# EAGLE design os23ac (EAGLE 7.2.0)
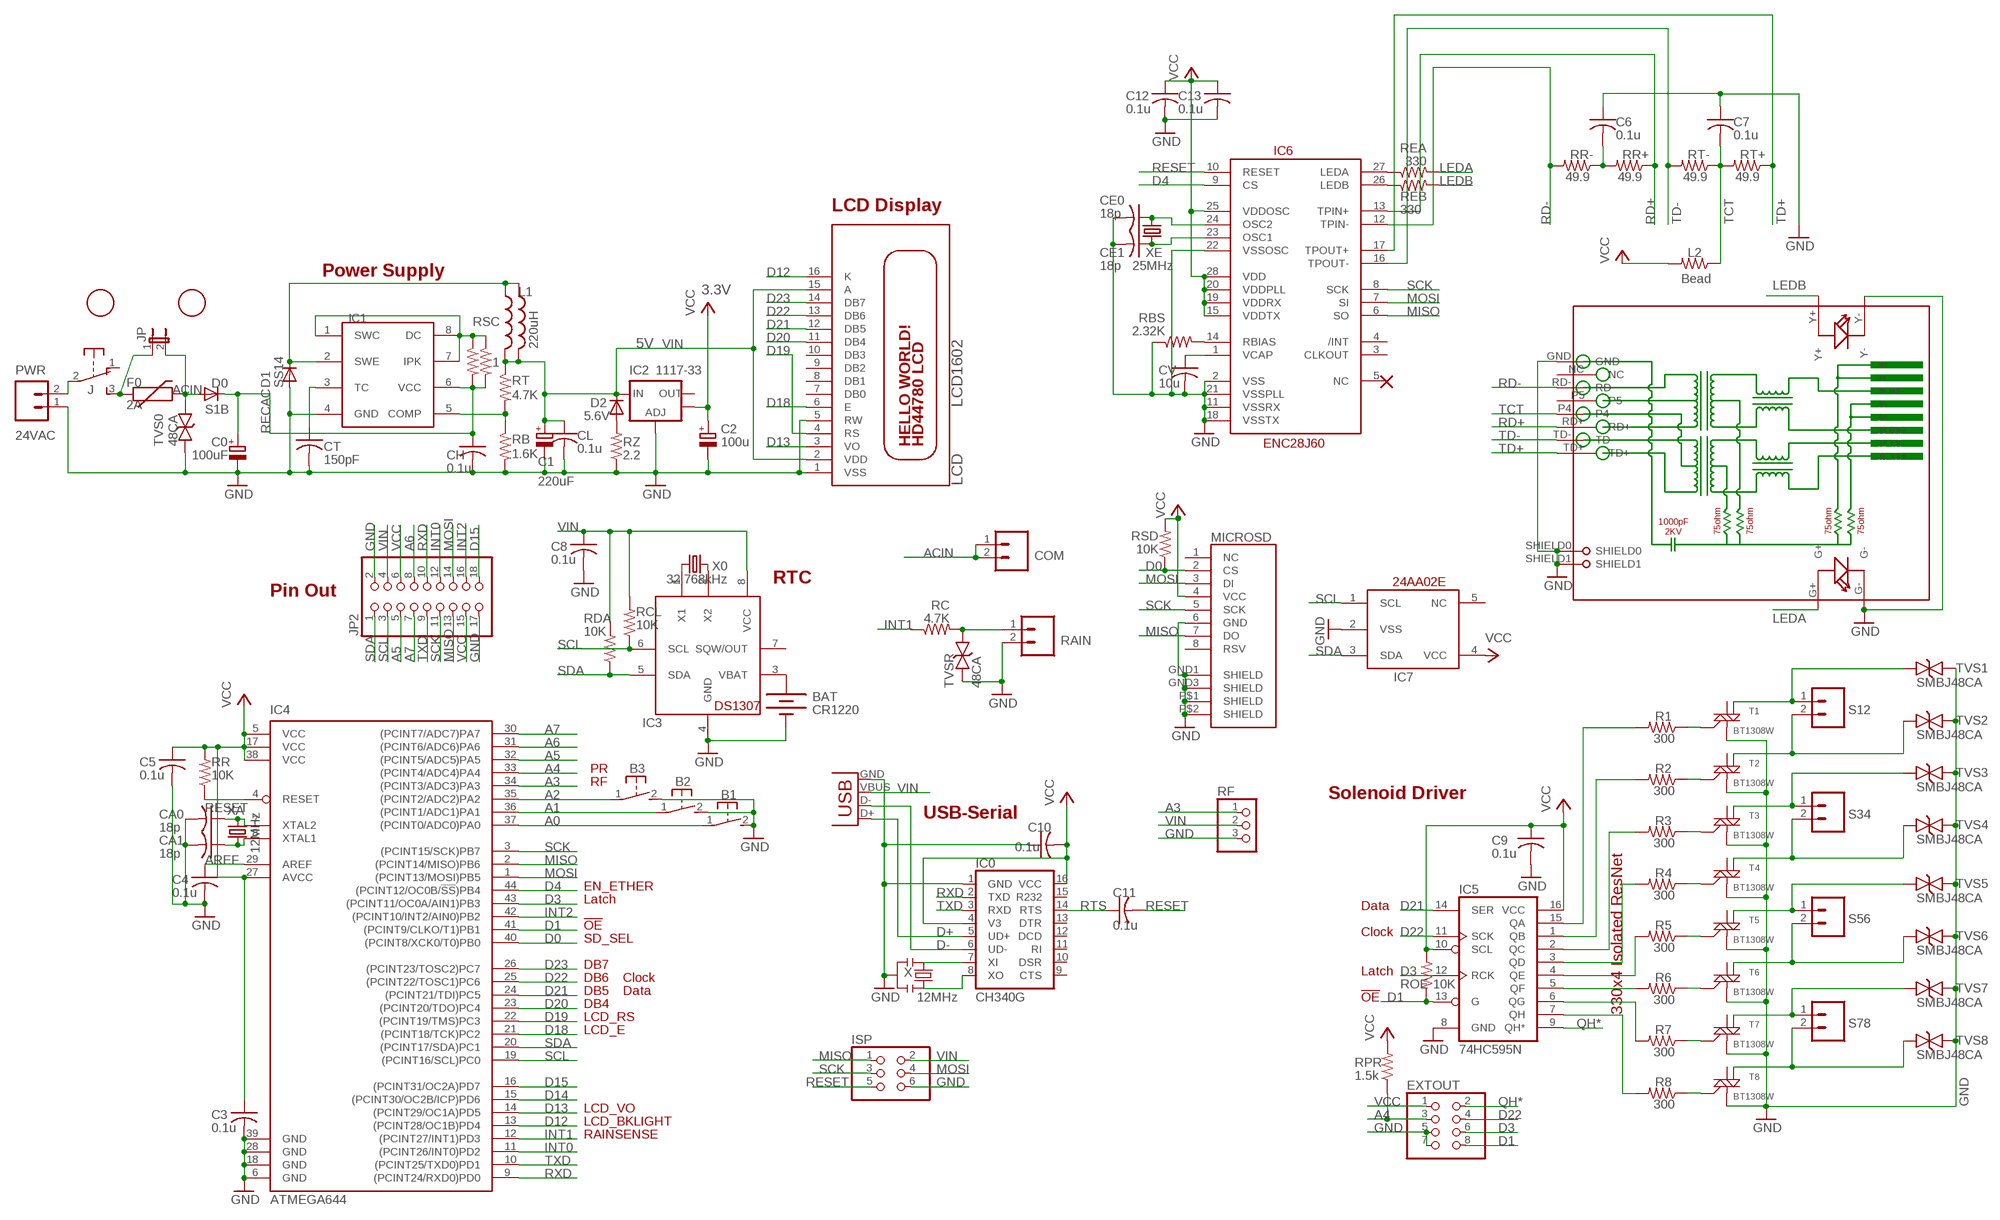
[diagram p0: schematic, sheet 1]

## Parts
B1  31-XX  [B3F-31XX]
B2  31-XX  [B3F-31XX]
B3  31-XX  [B3F-31XX]
BAT  CR1220  BATTERYBATTERY_12MM_SMT  [BATTCON_12MM_SMT]
C0  100uF  CPOL-EUE  [PANASONIC_E]
C1  220uF  CPOL-EUE  [PANASONIC_E]
C2  100u  CPOL-EUD  [PANASONIC_D]
C3  0.1u  C-USC0603K  [C0603K]
C4  0.1u  C-USC0603  [C0603]
C5  0.1u  C-USC0603  [C0603]
C6  0.1u  C-USC0603  [C0603]
C7  0.1u  C-USC0603K  [C0603K]
C8  0.1u  C-USC0603  [C0603]
C9  0.1u  C-USC0603  [C0603]
C10  0.1u  C-USC0603  [C0603]
C11  0.1u  C-USC0603  [C0603]
C12  0.1u  C-USC0603  [C0603]
C13  0.1u  C-USC0603  [C0603]
CA0  18p  C-USC0603K  [C0603K]
CA1  18p  C-USC0603K  [C0603K]
CE0  18p  C-USC0603K  [C0603K]
CE1  18p  C-USC0603K  [C0603K]
CH  0.1u  C-USC0603  [C0603]
CL  0.1u  C-USC0603  [C0603]
COM  M025MM-X  [SCREWTERMINAL-5MM-2-X]
CT  150pF  C-USC0603K  [C0603K]
CV  10u  C-USC0805K  [C0805K]
D0  S1B  DIODE-DO-214AC  [DO-214AC]
D1  SS14  DIODE-DO-214AC  [DO-214AC]
D2  5.6V  DIODE-MINIMELF  [MINIMELF]
EXTOUT  PINHD-2X4  [2X04]
F0  2A  PTCSMD  [PTC-1206]
IC0  CH340G  [SO16]
IC1  34063  MC33063/MC34063D  [SO08]
IC2  1117-33  V_REG_LM1117SOT223  [SOT223]
IC3  DS1307  DS1307SOIC  [SO08]
IC4  ATMEGA644  ATMEGA644A  [TQFP44]
IC5  74HC595N  74LS595D  [SO16]
IC6  ENC28J60  [SSOP28DB]
IC7  24AA02E  24AA02E48  [SOT23-5L]
ISP  PINHD-2X3  [2X03]
J  EG1206  [EG1206]
JP  JUMPER-2PTH  [1X02]
JP2  PINHD-2X9-CBIG  [2X09-CLEANBIG]
L1  INDUCTORPWR  [CDRH125]
L1'  220uH  L-US0204/5  [0204/5]
L2  Bead  R-US_R0805  [R0805]
LCD  LCD1602  HD44780LCDNOHOLE  [LCD1602A]
MICROSD  USD-SOCKETMICRO-SD-SOCKET-TAOBAO  [MICRO-SD-SOCKET-TAOBAO]
PWR  24VAC  M024MM-X  [SCREWTERMINAL-4MM-2-X]
R1  300  R-US_R0603  [R0603]
R2  300  R-US_R0603  [R0603]
R3  300  R-US_R0603  [R0603]
R4  300  R-US_R0603  [R0603]
R5  300  R-US_R0603  [R0603]
R6  300  R-US_R0603  [R0603]
R7  300  R-US_R0603  [R0603]
R8  300  R-US_R0603  [R0603]
RAIN  M025MM-X  [SCREWTERMINAL-5MM-2-X]
RB  1.6K  R-US_R0603  [R0603]
RBS  2.32K  R-US_R0805  [R0805]
RC  4.7K  R-US_R0805  [R0805]
RCL  10K  R-US_R0603  [R0603]
RDA  10K  R-US_R0603  [R0603]
REA  330  R-US_R0603  [R0603]
REB  330  R-US_R0603  [R0603]
RF  PINHD-1X3  [1X03]
RJ45  HR911105A  [HR911105A]
ROE  10K  R-US_R0603  [R0603]
RPR  1.5k  R-US_R0603  [R0603]
RR  10K  R-US_R0603  [R0603]
RR+  49.9  R-US_R0603  [R0603]
RR-  49.9  R-US_R0603  [R0603]
RSC  1  R-US_R0805  [R0805]
RSC1  1  R-US_R0805  [R0805]
RSD  10K  R-US_R0603  [R0603]
RT  4.7K  R-US_R0805  [R0805]
RT+  49.9  R-US_R0603  [R0603]
RT-  49.9  R-US_R0603  [R0603]
RZ  2.2  R-US_R2010  [R2010]
S12  M025MM-X  [SCREWTERMINAL-5MM-2-X]
S34  M025MM-X  [SCREWTERMINAL-5MM-2-X]
S56  M025MM-X  [SCREWTERMINAL-5MM-2-X]
S78  M025MM-X  [SCREWTERMINAL-5MM-2-X]
T1  BT1308W  MAC97SOT223  [SOT223]
T2  BT1308W  MAC97SOT223  [SOT223]
T3  BT1308W  MAC97SOT223  [SOT223]
T4  BT1308W  MAC97SOT223  [SOT223]
T5  BT1308W  MAC97SOT223  [SOT223]
T6  BT1308W  MAC97SOT223  [SOT223]
T7  BT1308W  MAC97SOT223  [SOT223]
T8  BT1308W  MAC97SOT223  [SOT223]
TVS0  48CA  DIODE-BTVSSMB  [SMB]
TVS1  SMBJ48CA  DIODE-BTVSSMB  [SMB]
TVS2  SMBJ48CA  DIODE-BTVSSMB  [SMB]
TVS3  SMBJ48CA  DIODE-BTVSSMB  [SMB]
TVS4  SMBJ48CA  DIODE-BTVSSMB  [SMB]
TVS5  SMBJ48CA  DIODE-BTVSSMB  [SMB]
TVS6  SMBJ48CA  DIODE-BTVSSMB  [SMB]
TVS7  SMBJ48CA  DIODE-BTVSSMB  [SMB]
TVS8  SMBJ48CA  DIODE-BTVSSMB  [SMB]
TVSR  48CA  DIODE-BTVSSMB  [SMB]
U$1  FIDUCIAL  [FIDUCIAL_1MM]
U$3  FIDUCIAL  [FIDUCIAL_1MM]
USB  USBPTH  [USB-B-PTH]
X  12MHz  RESONATORSMD  [RESONATOR-SMD]
X0  32.768kHz  CRYSTALMM20SS  [MM20SS]
XA  12MHz  CRYSTAL4SMD  [4SMD]
XE  25MHz  CRYSTAL4SMD  [4SMD]

## Nets
A0: B1.1(P) IC4.37((PCINT0/ADC0)PA0)
A1: B2.1(P) IC4.36((PCINT1/ADC1)PA1)
A2: B3.1(P) IC4.35((PCINT2/ADC2)PA2)
A3: IC4.34((PCINT3/ADC3)PA3) RF.1
A4: EXTOUT.3 IC4.33((PCINT4/ADC4)PA4) RPR.1
A5: IC4.32((PCINT5/ADC5)PA5) JP2.5
A6: IC4.31((PCINT6/ADC6)PA6) JP2.8
A7: IC4.30((PCINT7/ADC7)PA7) JP2.7
ACIN [power]: COM.1 COM.2 D0.A F0.2 JP.2 TVS0.C
AREF: C4.1 IC4.29(AREF)
D0: IC4.40((PCINT8/XCK0/T0)PB0) MICROSD.2(CS) RSD.1
D1: EXTOUT.8 IC4.41((PCINT9/CLKO/T1)PB1) IC5.13(G) ROE.1
D3: EXTOUT.6 IC4.43((PCINT11/OC0A/AIN1)PB3) IC5.12(RCK)
D4: IC4.44((PCINT12/OC0B/!SS!)PB4) IC6.9(CS)
D12: IC4.13((PCINT28/OC1B)PD4) LCD.16(K)
D13: IC4.14((PCINT29/OC1A)PD5) LCD.3(VO)
D14: IC4.15((PCINT30/OC2B/ICP)PD6)
D15: IC4.16((PCINT31/OC2A)PD7) JP2.18
D18: IC4.21((PCINT18/TCK)PC2) LCD.6(E)
D19: IC4.22((PCINT19/TMS)PC3) LCD.4(RS)
D20: IC4.23((PCINT20/TDO)PC4) LCD.11(DB4)
D21: IC4.24((PCINT21/TDI)PC5) IC5.14(SER) LCD.12(DB5)
D22: EXTOUT.4 IC4.25((PCINT22/TOSC1)PC6) IC5.11(SCK) LCD.13(DB6)
D23: IC4.26((PCINT23/TOSC2)PC7) LCD.14(DB7)
D+: IC0.5(UD+) USB.D+
D-: IC0.6(UD-) USB.D-
GND: B1.2(S) B2.2(S) B3.2(S) BAT.P$1(-) C0.- C1.- C2.- C3.2 C4.2 C5.2 C6.1 C7.1 C8.2 C9.2 C10.1 C12.2 C13.2 CA0.2 CA1.2 CE0.2 CE1.2 CH.2 CL.2 CT.2 CV.2 D1.A EXTOUT.5 EXTOUT.7 IC0.1(GND) IC1.4(GND) IC2.1(ADJ) IC3.4(GND) IC4.6(GND) IC4.18(GND) IC4.28(GND) IC4.39(GND) IC5.8(GND) IC6.2(VSS) IC6.11(VSSRX) IC6.18(VSSTX) IC6.21(VSSPLL) IC6.22(VSSOSC) IC7.2(VSS) ISP.6 JP2.2 JP2.17 LCD.1(VSS) LCD.5(RW) MICROSD.6(GND) MICROSD.GND1(SHIELD) MICROSD.GND3(SHIELD) MICROSD.P$1(SHIELD) MICROSD.P$2(SHIELD) PWR.1 RAIN.2 RB.2 RBS.1 RF.3 RJ45.G- RJ45.GND RJ45.SHIELD0 RJ45.SHIELD1 RJ45.Y- RZ.1 T1.1(M1) T2.1(M1) T3.1(M1) T4.1(M1) T5.1(M1) T6.1(M1) T7.1(M1) T8.1(M1) TVS0.A TVS1.C TVS2.C TVS3.C TVS4.C TVS5.C TVS6.C TVS7.C TVS8.C TVSR.A USB.GND X.2
INT0: IC4.11((PCINT26/INT0)PD2) JP2.12
INT1: IC4.12((PCINT27/INT1)PD3) RC.1
INT2: IC4.42((PCINT10/INT2/AIN0)PB2) JP2.16
LEDA: REA.2 RJ45.G+
LEDB: REB.2 RJ45.Y+
MISO: IC4.2((PCINT14/MISO)PB6) IC6.6(SO) ISP.1 JP2.13 MICROSD.7(DO)
MOSI: IC4.1((PCINT13/MOSI)PB5) IC6.7(SI) ISP.4 JP2.14 MICROSD.3(DI)
N$1: J.2(P) PWR.2
N$3: RAIN.1 RC.2 TVSR.C
N$4: IC5.5(QF) R6.2
N$5: IC5.6(QG) R7.2
N$6: IC0.7(XI) X.1
N$7: IC5.7(QH) R8.2
N$8: IC3.1(X1) X0.1
N$9: F0.1 J.3(S) JP.1
N$10: IC5.4(QE) R5.2
N$11: IC5.3(QD) R4.2
N$12: IC5.2(QC) R3.2
N$13: IC5.1(QB) R2.2
N$14: IC5.15(QA) R1.2
N$15: CA0.1 IC4.7(XTAL2) XA.1
N$16 [power]: S12.1 T1.4(M2-4) TVS1.A
N$17 [power]: S12.2 T2.4(M2-4) TVS2.A
N$18 [power]: S34.1 T3.4(M2-4) TVS3.A
N$19: CA1.1 IC4.8(XTAL1) XA.3
N$20 [power]: S34.2 T4.4(M2-4) TVS4.A
N$21: R1.1 T1.3(G)
N$22 [power]: S56.1 T5.4(M2-4) TVS5.A
N$23 [power]: S56.2 T6.4(M2-4) TVS6.A
N$24 [power]: S78.1 T7.4(M2-4) TVS7.A
N$25 [power]: S78.2 T8.4(M2-4) TVS8.A
N$26: R2.1 T2.3(G)
N$27: R3.1 T3.3(G)
N$28: R4.1 T4.3(G)
N$29: R5.1 T5.3(G)
N$30: IC3.2(X2) X0.4
N$31: R6.1 T6.3(G)
N$33: R7.1 T7.3(G)
N$34: IC6.27(LEDA) REA.1
N$35: R8.1 T8.3(G)
N$36: BAT.P$2(+) IC3.3(VBAT)
N$37: IC6.26(LEDB) REB.1
N$39: CV.1 IC6.1(VCAP)
N$40: IC0.8(XO) X.3
N$41: CE0.1 IC6.24(OSC2) XE.3
N$42: CE1.1 IC6.23(OSC1) XE.1
N$43: D2.A RZ.2
N$45 [power]: IC1.1(SWC) IC1.7(IPK) IC1.8(DC) RSC1.1 RSC.1
N$46 [power]: D1.C IC1.2(SWE) L1'.1 L1.1
N$49: CT.1 IC1.3(TC)
N$54: C6.2 RR+.2 RR-.1
N$55: IC1.5(COMP) RB.1 RT.2
N$59: IC6.14(RBIAS) RBS.2
QH*: EXTOUT.2 IC5.9(QH*)
RD+: IC6.13(TPIN+) RJ45.RD+ RR+.1
RD-: IC6.12(TPIN-) RJ45.RD- RR-.2
RECAC [power]: C0.+ CH.1 D0.C IC1.6(VCC) RSC1.2 RSC.2
RESET: C11.2 IC4.4(RESET) IC6.10(RESET) ISP.5 RR.1
RTS: C11.1 IC0.14(RTS)
RXD: IC0.2(TXD) IC4.9((PCINT24/RXD0)PD0) JP2.10
SCK: IC4.3((PCINT15/SCK)PB7) IC6.8(SCK) ISP.3 JP2.11 MICROSD.5(SCK)
SCL: IC3.6(SCL) IC4.19((PCINT16/SCL)PC0) IC7.1(SCL) JP2.3 RCL.1
SDA: IC3.5(SDA) IC4.20((PCINT17/SDA)PC1) IC7.3(SDA) JP2.1 RDA.1
TCT: C7.2 L2.1 RJ45.P4 RT+.2 RT-.1
TD+: IC6.17(TPOUT+) RJ45.TD+ RT+.1
TD-: IC6.16(TPOUT-) RJ45.TD- RT-.2
TXD: IC0.3(RXD) IC4.10((PCINT25/TXD0)PD1) JP2.9
VCC: C2.+ C3.1 C5.1 C9.1 C10.2 C12.1 C13.1 EXTOUT.1 IC0.4(V3) IC0.16(VCC) IC2.4(OUT) IC4.5(VCC) IC4.17(VCC) IC4.27(AVCC) IC4.38(VCC) IC5.10(SCL) IC5.16(VCC) IC6.15(VDDTX) IC6.19(VDDRX) IC6.20(VDDPLL) IC6.25(VDDOSC) IC6.28(VDD) IC7.4(VCC) JP2.6 JP2.15 L2.2 MICROSD.4(VCC) ROE.2 RPR.2 RR.2 RSD.2
VIN [power]: C1.+ C8.1 CL.1 D2.C IC2.3(IN) IC3.8(VCC) ISP.2 JP2.4 L1'.2 L1.2 LCD.2(VDD) LCD.15(A) RCL.2 RDA.2 RF.2 RT.1 USB.VBUS
Unconnected: IC0.9(CTS) IC0.10(DSR) IC0.11(RI) IC0.12(DCD) IC0.13(DTR) IC0.15(R232) IC2.2(OUT) IC3.7(SQW/OUT) IC6.3(CLKOUT) IC6.4(/INT) IC6.5(NC) IC7.5(NC) J.1(O) LCD.7(DB0) LCD.8(DB1) LCD.9(DB2) LCD.10(DB3) MICROSD.1(NC) MICROSD.8(RSV) RJ45.NC RJ45.P5 T1.2(M2) T2.2(M2) T3.2(M2) T4.2(M2) T5.2(M2) T6.2(M2) T7.2(M2) T8.2(M2)

## Notes on the sheet
- LCD Display
- Power Supply
- 3.3V
- 5V
- RTC
- Pin Out
- PR
- RF
- Solenoid Driver
- USB-Serial
- EN_ETHER
- Latch
- Data
- !OE
- Clock
- SD_SEL
- DB7
- Latch
- DB6 | Clock
- DB5 | Data
- !OE
- DB4
- 330x4 Isolated ResNet
- LCD_RS
- LCD_E
- LCD_VO
- LCD_BKLIGHT
- RAINSENSE

## Library data of the parts
B1-B3 = adafruit:31-XX: OMRON SWITCH Now with beefier pads!
BAT = SparkFunNew:BATTERY: Battery Holders Various common sizes : AA, AAA, 20mm coin cell and 12mm coin cell.
C0 C1 C2 = resistor:CPOL-EU: POLARIZED CAPACITOR, European symbol
C3-C13 CA0 CA1 CE0 CE1 CH CL CT CV = adafruit:C-US: CAPACITOR, American symbol
COM PWR RAIN S12 S34 S56 S78 = SparkFun:M02: Header 2 Standard 2-pin 0.1" header. Use with straight break away headers (SKU : PRT-00116), right angle break away headers (PRT-00553), swiss pins (PRT-00743), machine pins (PRT-00117), and female headers (PRT-00115). Molex polarized connector foot print use with SKU : PRT-08233 with associated crimp pins and housings.
D0 D1 D2 = diode:DIODE-: DIODE
EXTOUT = pinhead:PINHD-2X4: PIN HEADER
F0 = SparkFun:PTC: Resettable Fuse PTC Resettable Fuse. Spark Fun Electronics SKU : COM-08357
IC0 = SparkFunNew:CH340
IC1 = adafruit:MC33063/MC34063: MC33063 and MC34063 Basic DC/DC converter with internal power-NPN transistor, 100KHz, 1.5A peak switch current. 3-40 input/output.
IC2 = SparkFun:V_REG_LM1117: Voltage Regulator LM1117 Standard adjustable voltage regulator but in SMD form. Spark Fun Electronics SKU : COM-00595
IC3 = adafruit:DS1307: DS1307 Real time clock (RTC) with battery backup ability. Talk to it via i2c
IC4 = atmel:ATMEGA644: 8-bit Microcontroller with 64K Bytes In-System Programmable Flash Source: http://www.atmel.com/dyn/resources/prod_documents/doc2593.pdf; MPN: ATMEGA644PV-10AU; OC_FARNELL: 1455123; OC_NEWARK: 58M3748
IC5 = SparkFun:74*595: 8-bit SHIFT REGISTER, output latch
IC6 = SparkFun:ENC28J60
IC7 = adafruit:24AA02E48
ISP = pinhead:PINHD-2X3: PIN HEADER
J = adafruit:EG1206
JP = SparkFun:JUMPER-2: Jumper Basic 0.1" spaced jumper. Use with breakaway headers.
JP2 = adafruit:PINHD-2X9: PIN HEADER With larger annulars
L1 = SparkFunNew:INDUCTOR: Inductors Basic Inductor/Choke - 0603 and 1206. Footprints are not proven and vary greatly between part numbers.
L1' = rcl:L-US: INDUCTOR, American symbol
L2 R1-R8 RC RCL RDA ROE RPR RR RSD = adafruit2013:R-US_: RESISTOR, American symbol
LCD = adafruit:HD44780LCD: HD44780 LCD Standard character type LCDs, available in sizes from 8x1 to 40x4!
MICROSD = SparkFunNew:USD-SOCKET: microSD Socket Push-push type uSD socket. Schematic element and footprint production proven. Spark Fun Electronics SKU : PRT-00127. tDoc lines correctly indicate media card edge positions when inserting (unlocked, locked, depressed).
RB RBS REA REB RR+ RR- RSC RSC1 RT RT+ RT- RZ = adafruitGood:R-US_: RESISTOR, American symbol
RF = pinhead:PINHD-1X3: PIN HEADER
RJ45 = CONNECTER:HR911105A
T1-T8 = SparkFun:MAC97: MAC97 Triac http://www.onsemi.com/pub_link/Collateral/MAC97-D.PDF
TVS0 TVS1-TVS8 TVSR = diode:DIODE-BTVS
U$1 U$3 = adafruitGood:FIDUCIAL: For use by pick and place machines to calibrate the vision/machine, 1mm By microbuilder.eu
USB = SparkFunNew:USB: USB Connectors USB-B-PTH is fully proven SKU : PRT-00139 USB-miniB is fully proven SKU : PRT-00587 USB-A-PCB is untested. USB-A-H is throughly reviewed, but untested. Spark Fun Electronics SKU : PRT-00437 USB-B-SMT is throughly reviewed, but untested. Needs silkscreen touching up. USB-A-S has not been used/tested USB-MB-H has not been used/tested
X = SparkFunNew:RESONATOR: Resonator Small SMD resonator. This is the itty bitty 10/20MHz resonators with built in caps. CSTCE10M0G55 and CSTCE20M0V53. Footprint has been reviewed closely but hasn't been tested yet.
X0 = crystal:CRYSTAL: CRYSTAL; OC_FARNELL: unknown; OC_NEWARK: unknown
XA XE = adafruit_3:CRYSTAL: CRYSTAL

## Net classes
0 default: width 0.203 mm, clearance 0.178 mm
1 power: width 0.305 mm, clearance 0.178 mm
2 relaypower: width 0.813 mm, clearance 0.305 mm

## Board
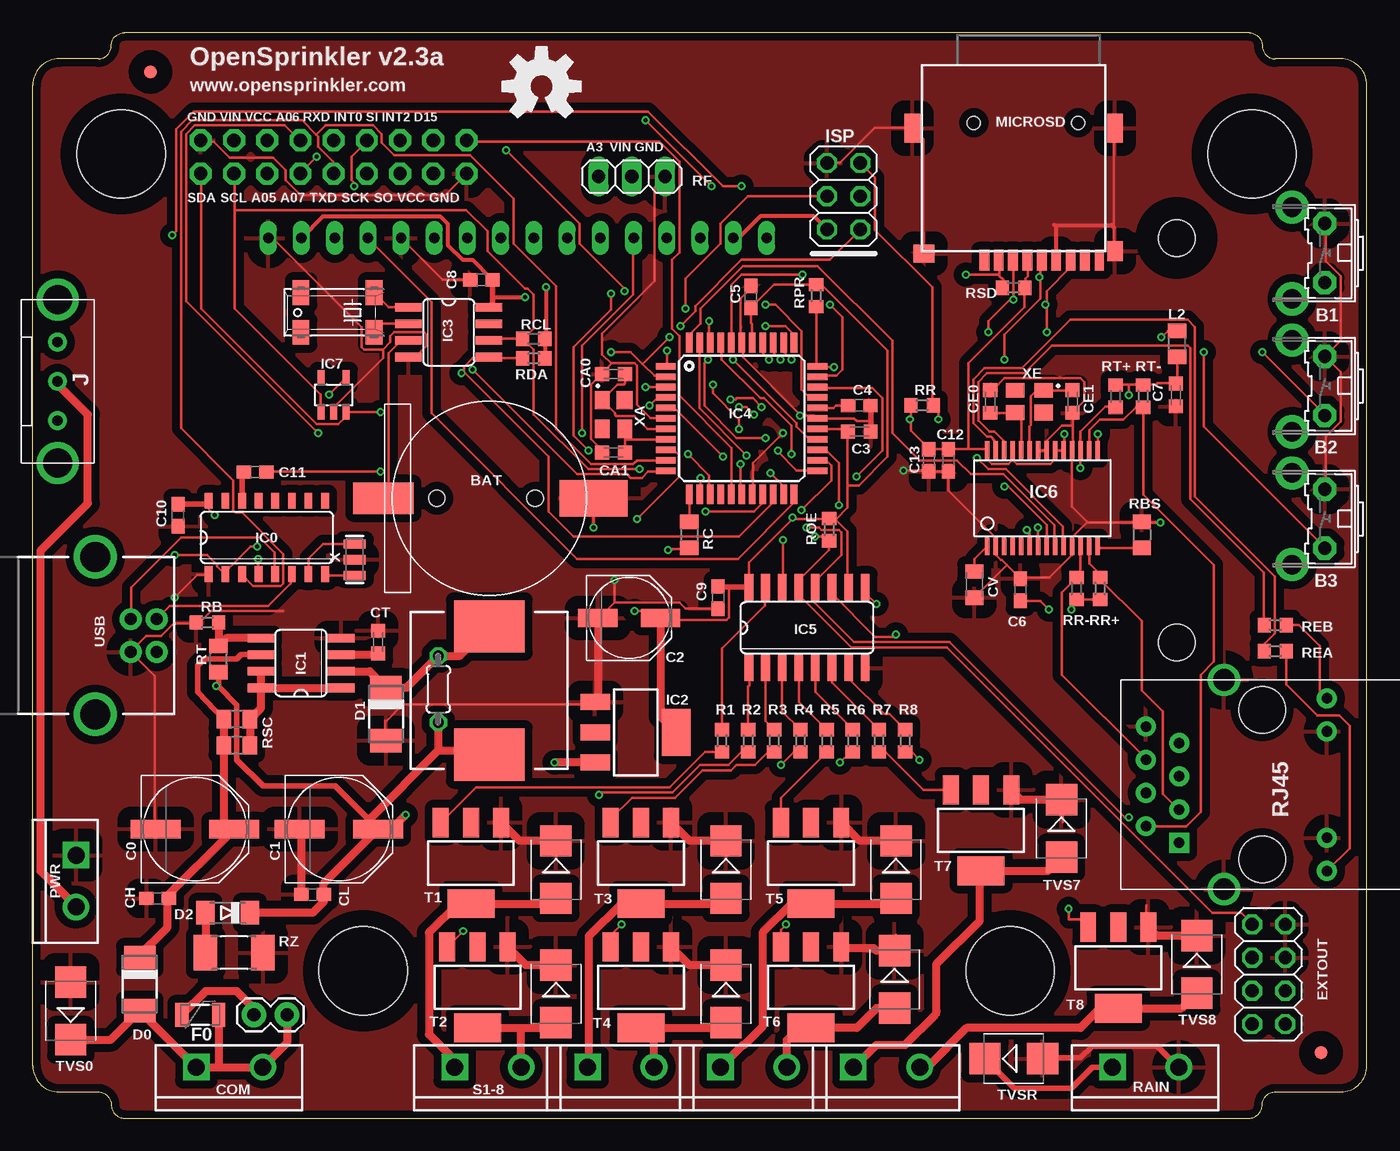
[diagram p1: board, top side]
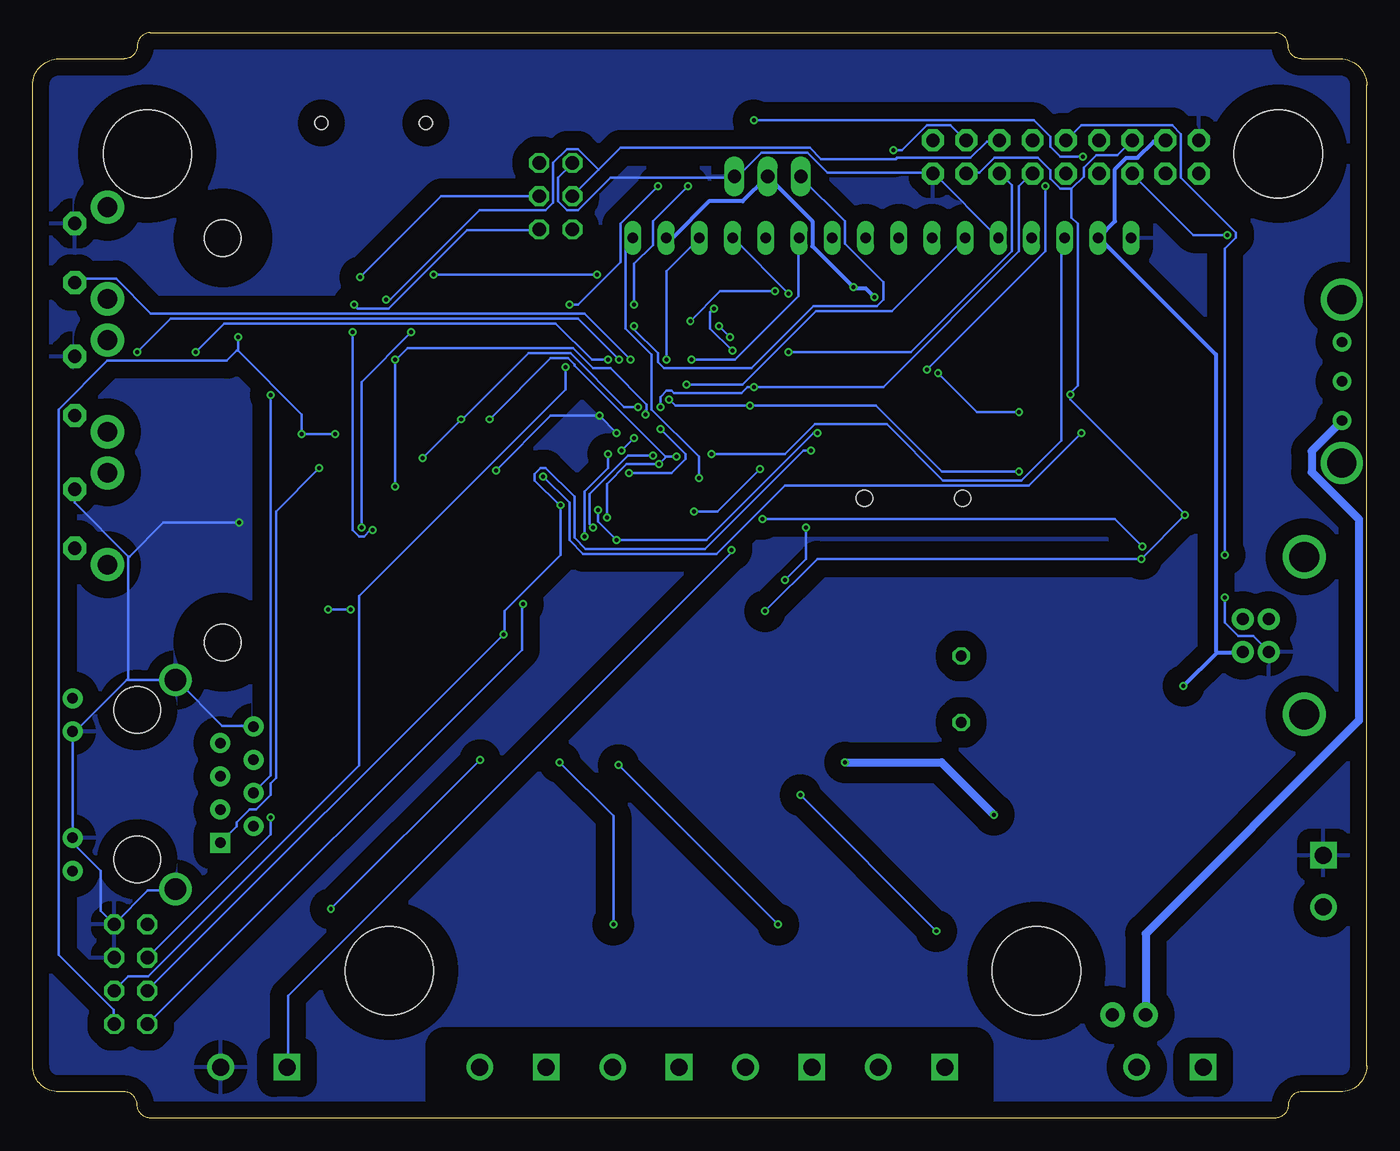
[diagram p2: board, bottom side, seen from below]

Size 102 x 83 mm. Coordinates in mm from the lower left corner, seen from the top.
Outline: 100,81 95,81 arc-90 94,82 arc90 93,83 7,83 arc90 6,82 arc-90 5,81 2,81 arc90 0,79 0,4 arc90 2,2 5,2 arc-90 6,1 arc90 7,0 93,0 arc90 94,1 arc-90 95,2 100,2 arc90 102,4 102,79 arc90 100,81
Copper layers (1*16): Top 0.035mm / dielectric 1.5mm / Bottom 0.035mm
Design rules "Fusion_eagle_rule_v1.1 *": minimum track width 6mil, minimum drill 12mil, track to track 6mil, track to pad 6mil, pad to pad 6mil, via to via 6mil, smd to smd 0mil, copper to edge 10mil, drill to drill 10mil, minimum pad ring 10mil, minimum via ring 6mil, stop-mask expansion 2mil, vias tented up to drill 100mil, thermal gap 40mil
Holes 2.8 mm at 87.46,67.3 87.46,36.38
Holes 6.75 mm at 6.76,73.74 93.24,73.74 25.26,11.26 74.74,11.26
tRestrict: area 85,33.9 to 90,38.9; area 85,64.8 to 90,69.8; area 2.8,69.7 to 10.8,77.7; area 89.2,69.7 to 97.2,77.7; area 21.3,7.3 to 29.3,15.3; area 70.7,7.3 to 78.7,15.3
bRestrict: area 2.8,69.7 to 10.8,77.7; area 89.2,69.7 to 97.2,77.7; area 21.3,7.3 to 29.3,15.3; area 70.7,7.3 to 78.7,15.3; area 85,64.8 to 90,69.8; area 85,33.9 to 90,38.9; area 30,1.5 to 70.5,5.5
vRestrict: area 11.8,70 to 34.2,70.8; area 11.8,76.2 to 34.3,76.9; area 36.5,72.7 to 43.2,73.4

### Footprints (pad centres in the part's own frame; a part is rotated, then mirrored left to right if it is on the bottom)
B3F-31XX = drill 1.016 pad 1.778 octagon: 1 -2.261,-1.245; 2 2.261,-1.245 | drill 1.499 pad 2.54: 3 -3.505,1.245; 4 3.505,1.245
BATTCON_12MM_SMT = smd 2.8 x 5.2: P$1 0,11.96 | smd 2.4 x 4.6: P$2 0,-4.1 | hole 1.25: 0,7.5; 0,0
PANASONIC_E = smd 3.8 x 1.4: + 3,0; - -3,0
PANASONIC_D = smd 3 x 1.4: + 2.4,0; - -2.4,0
C0603K = smd 1.05 x 1.08: 1 -0.875,0; 2 0.875,0
C0603 = smd 1.1 x 1: 1 -0.85,0; 2 0.85,0
SCREWTERMINAL-5MM-2-X = drill 1.3 pad 2.032 square: 1 0,0 | drill 1.3 pad 2.032: 2 5.08,0
C0805K = smd 1.1 x 1.4: 1 -1,0; 2 1,0
DO-214AC = smd 1.8 x 2.4: A 2.025,0; C -2.025,0
MINIMELF = smd 1.4 x 1.8: A 1.7,0; C -1.7,0
2X04 = drill 1.016 octagon: 1 -3.81,-1.27; 2 -3.81,1.27; 3 -1.27,-1.27; 4 -1.27,1.27; 5 1.27,-1.27; 6 1.27,1.27; 7 3.81,-1.27; 8 3.81,1.27
PTC-1206 = smd 1 x 1.8: 1 -1.4,0; 2 1.4,0
SO16 = smd 0.6 x 1.2: 1 -4.445,-2.8; 2 -3.175,-2.8; 3 -1.905,-2.8; 4 -0.635,-2.8; 5 0.635,-2.8; 6 1.905,-2.8; 7 3.175,-2.8; 8 4.445,-2.8; 9 4.445,2.8; 10 3.175,2.8; 11 1.905,2.8; 12 0.635,2.8; 13 -0.635,2.8; 14 -1.905,2.8; 15 -3.175,2.8; 16 -4.445,2.8
SO08 = smd 0.66 x 2.032: 1 -1.905,-3.073; 2 -0.635,-3.073; 3 0.635,-3.073; 4 1.905,-3.073; 5 1.905,3.073; 6 0.635,3.073; 7 -0.635,3.073; 8 -1.905,3.073
SOT223 = smd 1.219 x 2.235: 1 -2.311,-3.099; 2 0,-3.099; 3 2.311,-3.099 | smd 3.6 x 2.2: 4 0,3.099
TQFP44 = smd 1.5 x 0.5: 1 -5.8,4; 2 -5.8,3.2; 3 -5.8,2.4; 4 -5.8,1.6; 5 -5.8,0.8; 6 -5.8,0; 7 -5.8,-0.8; 8 -5.8,-1.6; 9 -5.8,-2.4; 10 -5.8,-3.2; 11 -5.8,-4; 23 5.8,-4; 24 5.8,-3.2; 25 5.8,-2.4; 26 5.8,-1.6; 27 5.8,-0.8; 28 5.8,0; 29 5.8,0.8; 30 5.8,1.6; 31 5.8,2.4; 32 5.8,3.2; 33 5.8,4 | smd 0.5 x 1.5: 12 -4,-5.8; 13 -3.2,-5.8; 14 -2.4,-5.8; 15 -1.6,-5.8; 16 -0.8,-5.8; 17 0,-5.8; 18 0.8,-5.8; 19 1.6,-5.8; 20 2.4,-5.8; 21 3.2,-5.8; 22 4,-5.8; 34 4,5.8; 35 3.2,5.8; 36 2.4,5.8; 37 1.6,5.8; 38 0.8,5.8; 39 0,5.8; 40 -0.8,5.8; 41 -1.6,5.8; 42 -2.4,5.8; 43 -3.2,5.8; 44 -4,5.8
SO16' = smd 0.66 x 2.032: 1 -4.445,-3.073; 2 -3.175,-3.073; 3 -1.905,-3.073; 4 -0.635,-3.073; 5 0.635,-3.073; 6 1.905,-3.073; 7 3.175,-3.073; 8 4.445,-3.073; 9 4.445,3.073; 10 3.175,3.073; 11 1.905,3.073; 12 0.635,3.073; 13 -0.635,3.073; 14 -1.905,3.073; 15 -3.175,3.073; 16 -4.445,3.073
SSOP28DB = smd 0.348 x 1.397: 1 -4.225,-3.656; 2 -3.575,-3.656; 3 -2.925,-3.656; 4 -2.275,-3.656; 5 -1.625,-3.656; 6 -0.975,-3.656; 7 -0.325,-3.656; 8 0.325,-3.656; 9 0.975,-3.656; 10 1.625,-3.656; 11 2.275,-3.656; 12 2.925,-3.656; 13 3.575,-3.656; 14 4.225,-3.656; 15 4.225,3.656; 16 3.575,3.656; 17 2.925,3.656; 18 2.275,3.656; 19 1.625,3.656; 20 0.975,3.656; 21 0.325,3.656; 22 -0.325,3.656; 23 -0.975,3.656; 24 -1.625,3.656; 25 -2.275,3.656; 26 -2.925,3.656; 27 -3.575,3.656; 28 -4.225,3.656
SOT23-5L = smd 0.55 x 1.2: 1 -0.95,-1.3; 2 0,-1.3; 3 0.95,-1.3; 4 0.95,1.3; 5 -0.95,1.3
2X03 = drill 1.016 octagon: 1 -2.54,-1.27; 2 -2.54,1.27; 3 0,-1.27; 4 0,1.27; 5 2.54,-1.27; 6 2.54,1.27
EG1206 = drill 0.8 pad 1.422: 1 -3,0; 2 0,0; 3 3,0 | drill 2.2: MT1 -6.25,0; MT2 6.25,0
1X02 = drill 1.016 pad 1.88: 1 0,0; 2 2.54,0
2X09-CLEANBIG = drill 1.016 pad 1.676 octagon: 1 -10.16,-1.27; 2 -10.16,1.27; 3 -7.62,-1.27; 4 -7.62,1.27; 5 -5.08,-1.27; 6 -5.08,1.27; 7 -2.54,-1.27; 8 -2.54,1.27; 9 0,-1.27; 10 0,1.27; 11 2.54,-1.27; 12 2.54,1.27; 13 5.08,-1.27; 14 5.08,1.27; 15 7.62,-1.27; 16 7.62,1.27; 17 10.16,-1.27; 18 10.16,1.27
CDRH125 = smd 5.4 x 4: 1 0,4.9; 2 0,-4.9
0204/5 = drill 0.813 octagon: 1 -2.54,0; 2 2.54,0
R0805 = smd 1.1 x 1.4: 1 -1,0; 2 1,0
LCD1602A = drill 0.8 long: 1 8,33.46; 2 10.54,33.46; 3 13.08,33.46; 4 15.62,33.46; 5 18.16,33.46; 6 20.7,33.46; 7 23.24,33.46; 8 25.78,33.46; 9 28.32,33.46; 10 30.86,33.46; 11 33.4,33.46; 12 35.94,33.46; 13 38.48,33.46; 14 41.02,33.46; 15 43.56,33.46; 16 46.1,33.46
MICRO-SD-SOCKET-TAOBAO = smd 0.75 x 1.6: 1 2.25,10.5; 2 1.15,10.5; 3 0.05,10.5; 4 -1.05,10.5; 5 -2.15,10.5; 6 -3.25,10.5; 7 -4.35,10.5; 8 -5.45,10.5 | smd 0.7 x 1.6: CD -6.55,10.5 | smd 1.2 x 1.5: GND1 -7.75,9.8 | smd 1.6 x 1.4: GND3 6.85,10 | smd 1.2 x 2.2: P$1 7.75,0.4; P$2 -7.75,0.4 | hole 1: 3.05,0; -4.93,0
SCREWTERMINAL-4MM-2-X = drill 1.3 pad 2.032 square: 1 0,0 | drill 1.3 pad 2.032: 2 3.96,0
R0603 = smd 1 x 1.1: 1 -0.85,0; 2 0.85,0
1X03 = drill 1.016 long: 1 -2.54,0; 2 0,0; 3 2.54,0
HR911105A = drill 0.813 pad 1.524: G+ 4.953,-6.604; G- 4.953,-4.064; GND -8.89,4.445; NC -6.35,3.175; P4 -8.89,-0.635; P5 -6.35,0.635; RD+ -6.35,-1.905; RD- -8.89,1.905; TD- -8.89,-3.175; Y+ 4.953,6.604; Y- 4.953,4.064 | drill 1.651 pad 2.159: SHIELD0 -2.921,8.001; SHIELD1 -2.921,-8.001 | drill 0.813 pad 1.524 square: TD+ -6.35,-4.445 | hole 3.556: 0,-5.715; 0,5.715
R2010 = smd 1.8 x 2.7: 1 -2.2,0; 2 2.2,0
SMB = smd 2.4 x 2.4: A 2.2,0; C -2.2,0
FIDUCIAL_1MM = smd 1 x 1: 1 0,0
USB-B-PTH = drill 0.914 pad 1.676: D+ 0,1.25; D- 1.981,1.25; GND 0,-1.25; VBUS 1.981,-1.25 | drill 2.286: S1 -2.718,-6.02; S2 -2.718,6.02
RESONATOR-SMD = smd 0.7 x 1.7: 1 -1.2,0; 2 0,0; 3 1.2,0
MM20SS = smd 1.27 x 1.88: 1 -2.794,-1.524; 2 2.794,-1.524; 3 2.794,1.524; 4 -2.794,1.524
4SMD = smd 1.4 x 1.12: 1 -1.1,-0.85; 3 1.1,0.85 | smd 1.4 x 1.1: 2 1.1,-0.85 | smd 1.4 x 1.2: 4 -1.1,0.85

### Placement (x,y rotation side)
B1  97.54,66.15 90 top
B2  97.54,55.99 90 top
B3  97.54,45.83 90 top
BAT  30.9,47.4 270 top
C0  12.4,22.1 0 top
C1  23.4,22.1 0 top
C2  45.6,38.25 0 top
C3  63.2,52.5 0 top
C4  63.2,54.5 0 top
C5  54.9,62.8 90 top
C6  75.5,40.4 270 top
C7  87.4,55.3 90 top
C8  34.3,64.1 180 top
C9  52.4,39.8 270 top
C10  11.1,46.1 90 top
C11  17,49.4 0 top
C12  70,50.3 270 top
C13  68.5,50.3 270 top
CA0  44.4,56.9 180 top
CA1  44.4,50.9 180 top
CE0  73.2,54.8 90 top
CE1  79.5,54.8 270 top
CH  9.55,16.8 180 top
CL  21.4,17.1 180 top
COM  12.5,3.9 0 top
CT  26.4,36.4 90 top
CV  72,40.8 270 top
D0  8.18,10.25 270 top
D1  27,30.9 270 top
D2  14.9,15.7 180 top
EXTOUT  94.5,11 90 top
F0  12.8,7.9 0 top
IC0  17.9,44.4 0 top
IC1  20.5,34.8 90 top
IC2  46.1,29.5 270 top
IC3  31.8,60.1 270 top
IC4  54.2,53.5 0 top
IC5  74HC595N  [SO16']  59.2,37.5 0 top
IC6  77.2,47.4 0 top
IC7  23,55.3 0 top
ISP  62,70.5 90 top
J  1.9,56.34 270 top
JP  16.9,7.9 0 top
JP2  23,73.5 0 top
L1  34.9,32.7 0 top
L1'  31,32.8 270 top
L2  87.5,59.2 90 top
LCD  10,33.84 0 top
MICROSD  75,76.1 180 top
PWR  3.3,20.1 270 top
R1  52.7,28.85 90 top
R2  54.7,28.85 90 top
R3  56.7,28.85 90 top
R4  58.7,28.85 90 top
R5  60.7,28.85 90 top
R6  62.7,28.85 90 top
R7  64.7,28.85 90 top
R8  66.7,28.85 90 top
RAIN  82.55,3.9 0 top
RB  13.35,37.9 180 top
RBS  84.8,44.6 270 top
RC  50.2,44.6 270 top
RCL  38.3,59.6 0 top
RDA  38.3,58.1 0 top
REA  95,35.7 0 top
REB  95,37.7 0 top
RF  45.8,72 0 top
RJ45  94,25.5 0 top
ROE  60.9,45 90 top
RPR  59.9,62.9 90 top
RR  68,54.5 180 top
RR+  81.6,40.5 270 top
RR-  79.8,40.5 90 top
RSC  15.6,30.5 180 top
RSC1  15.6,28.5 180 top
RSD  75,63.5 0 top
RT  14.2,35.1 90 top
RT+  82.8,55.2 90 top
RT-  84.9,55.2 270 top
RZ  15.4,12.65 180 top
S12  32.26,3.9 0 top
S34  42.42,3.9 0 top
S56  52.58,3.9 0 top
S78  62.74,3.9 0 top
T1  33.5,19.5 180 top
T2  34,10 180 top
T3  46.5,19.5 180 top
T4  46.5,10 180 top
T5  59.5,19.5 180 top
T6  59.5,10 180 top
T7  72.5,22 180 top
T8  83,11.5 180 top
TVS0  2.9,8.2 90 top
TVS1  40,19 270 top
TVS2  40,9.5 270 top
TVS3  53,19 270 top
TVS4  53,9.5 270 top
TVS5  66,19 270 top
TVS6  65.9,10.6 270 top
TVS7  78.65,22.15 270 top
TVS8  89,11.75 270 top
TVSR  75,4.55 0 top
U$1  9,80 0 top
U$3  98.5,5 0 top
USB  7.5,36.9 0 top
X  24.6,42.7 270 top
X0  23.3,61.6 180 top
XA  44.4,53.8 270 top
XE  76.2,54.8 180 top

### Tracks (layer width: path | path; a pad name or v marks a point on that pad's centre or on a via)
A0  (via drill 0.3)
  Top 0.203: v56.29,58.01 55.82,58.48 55.82,59.24 IC4.37
  Bottom 0.203: v56.29,58.01 59.82,61.53 92.96,61.53 95.63,64.2 98.49,64.2 98.77,63.91 B1.1
A1  (via drill 0.3)
  Top 0.203: v57.15,58.01 56.67,58.48 56.67,59.24 IC4.36 | v94.01,58.58 98.77,53.82 B2.1
  Bottom 0.203: v57.15,58.01 60.29,61.15 91.44,61.15 v94.01,58.58
A2  (via drill 0.3)
  Top 0.203: v58.01,58.01 57.44,58.58 57.44,59.24 IC4.35 | v89.53,58.58 89.53,52.86 98.77,43.62 B3.1
  Bottom 0.203: v58.01,58.01 59.24,58.01 62.01,60.77 87.34,60.77 v89.53,58.58
A3  (via drill 0.3)
  Top 0.203: v56.01,60.58 57.53,60.58 58.2,59.91 58.2,59.34 IC4.34
  Bottom 0.203: v56.01,60.58 56.01,60.29 54.2,58.48 54.2,57.82 53.72,57.34 47.05,57.34 42.29,62.1 37.43,62.1 36.96,62.58 36.96,63.91 39.91,66.86 39.91,68.58 43.24,71.91 RF.1
A4  (via drill 0.3)
  Top 0.203: RPR.1 59.9,57.6 IC4.33 60.01,57.44 v61.25,57.44
  Bottom 0.203: v61.25,57.44 61.25,55.72 77.06,39.91 77.06,26.96 93.15,10.86 94.68,10.86 95.73,9.81 EXTOUT.3
A5  (via drill 0.3)
  Top 0.203: v60.96,62.2 61.91,61.24 61.91,57.24 61.44,56.77 60.01,56.77 IC4.32 | v54.2,71.25 52.77,71.25 47.05,76.96 12.29,76.96 10.95,75.63 10.95,67.82 v10.67,67.53
  Bottom 0.203: v60.96,62.2 60.29,62.2 57.05,65.44 57.05,68.39 v54.2,71.25 | v10.67,67.53 13.24,67.53 17.91,72.2 JP2.5
A6  (via drill 0.3)
  Top 0.203: v62.96,49.05 64.96,51.05 64.96,55.05 64.2,55.82 60.01,55.82 IC4.31 | v21.81,52.39 11.72,62.48 11.72,75.25 12.38,75.91 19.24,75.91 20.38,74.77 JP2.8
  Bottom 0.203: v62.96,49.05 60.96,47.05 60.96,44.2 59.91,43.15 49.72,43.15 44.48,48.39 25.81,48.39 v21.81,52.39
A7  (via drill 0.3)
  Top 0.203: v56.01,62.2 56.77,62.2 58.77,60.2 58.77,55.72 59.34,55.15 59.91,55.15 IC4.30 | v46.86,76.3 v51.91,71.25 | v21.72,73.53 20.48,72.29 JP2.7
  Bottom 0.203: v56.01,62.2 56.01,65.34 54.58,66.77 54.58,68.58 v51.91,71.25 | v46.86,76.3 25.43,76.3 24.19,75.06 24.19,74.3 23.43,73.53 v21.72,73.53
ACIN
  Top 0.61: TVS0.C 5.96,6 D0.A COM.1 14.4,3.9 | 14.4,3.9 COM.2 19.44,5.76 JP.2 | F0.2 14.2,4.1 14.4,3.9
AREF
  Top 0.203: IC4.29 61.2,54.3 61.4,54.5 C4.1
D0  (via drill 0.3)
  Top 0.203: 73.9,64.48 73.9,65.6 MICROSD.2 | 73.9,64.48 73.9,64.4 74.2,64.1 74.2,63.5 RSD.1 | v58.86,64.48 54.2,64.48 53.44,63.72 53.44,59.34 IC4.40 | 73.9,64.48 v71.34,64.48
  Bottom 0.203: v71.34,64.48 v58.86,64.48
D1  (via drill 0.3)
  Top 0.203: EXTOUT.8 93.2,14.9 92.4,15.7 90.2,15.7 69.9,36 62.6,36 58.6,40 58.6,40.5 IC5.13 58.58,40.67 58.58,41.15 60.87,43.43 60.87,44.1 ROE.1 60.77,44.1 60.39,44.48 v59.82,44.48 | v58.01,50.77 58.01,52.96 55.91,55.05 55.63,55.05 52.67,58.01 52.67,59.24 IC4.41
  Bottom 0.203: v58.01,50.77 58.01,49.72 59.82,47.91 v59.82,44.48
D3  (via drill 0.3)
  Top 0.203: v83.8,23 83.5,23 70.1,36.4 62.8,36.4 59.8,39.4 59.8,40.5 IC5.12 59.82,40.67 59.82,41.05 61.82,43.05 61.82,44.77 61.63,44.96 60.29,44.96 60.1,45.15 v59.15,45.15 | v54.58,50.67 50.96,54.29 50.96,59.24 IC4.43
  Bottom 0.203: v83.8,23 83.8,21.7 EXTOUT.6 | v54.58,50.67 56.48,50.67 59.44,47.72 59.44,45.43 v59.15,45.15
D4
  Top 0.203: IC6.9 78.11,43.81 78.11,45.34 74.2,49.24 71.72,49.24 70.67,50.29 67.82,50.29 65.72,52.39 65.72,59.44 60.01,65.15 54.29,65.15 51.05,61.91 51.05,60.77 50.29,60.01 50.29,59.34 IC4.44
D12  (via drill 0.3)
  Top 0.203: v51.05,48.96 51.05,47.72 IC4.13
  Bottom 0.203: v51.05,48.96 51.05,50.58 54.67,54.2 54.67,58.39 56.67,60.39 56.67,66.67 56.1,67.25 LCD.16
D13  (via drill 0.3)
  Top 0.203: v50.1,50.77 51.72,49.15 51.72,47.72 IC4.14
  Bottom 0.203: v50.1,50.77 44.48,50.77 42.2,53.05 36.67,53.05 32.38,48.77 26.38,48.77 23.34,51.82 23.34,67.06 23.15,67.25 LCD.3
D15
  Top 0.203: IC4.16 53.44,47.72 53.44,51.24 49.44,55.24 49.44,59.82 48.86,60.39 48.86,65.63 49.44,66.2 49.44,73.15 47.91,74.68 33.24,74.68 JP2.18
D18  (via drill 0.3)
  Top 0.203: v56.39,49.34 57.34,48.39 57.34,47.72 IC4.21 | v54.01,52.67 54.01,53.44 52.01,55.44 v52.01,56.1
  Bottom 0.203: v56.39,49.34 53.15,49.34 52.1,50.39 52.1,50.77 v54.01,52.67 | v52.01,56.1 47.72,56.1 42.1,61.72 36.29,61.72 30.77,67.25 LCD.6
D19
  Top 0.203: IC4.22 58.2,47.62 58.2,47.05 53.91,42.77 41.62,42.77 30.48,53.91 30.48,62.39 25.62,67.25 LCD.4
D20  (via drill 0.3)
  Top 0.203: v56.96,51.05 56.96,50.96 58.39,49.53 59.91,49.53 IC4.23 | v56.01,52.01 53.82,52.01 51.34,54.48 51.34,57.72 v51.63,58.01
  Bottom 0.203: v56.01,52.01 v56.96,51.05 | v51.63,58.01 48.29,58.01 43.43,62.87 43.43,67.25 LCD.11
D21  (via drill 0.3)
  Top 0.203: v58.77,46.48 61.05,48.77 61.05,49.91 60.67,50.29 IC4.24 | v57.34,44.2 57.34,40.58 IC5.14 | v42.01,52.39 42.01,59.05 45.91,62.96 45.91,67.25 LCD.12
  Bottom 0.203: v58.77,46.48 58.77,45.62 v57.34,44.2 50.48,44.2 42.29,52.39 v42.01,52.39
D22  (via drill 0.3)
  Top 0.203: v66,37 65.8,36.8 64.4,36.8 61.1,40.1 61.1,40.5 IC5.11 | v61.63,46.86 61.63,50.1 60.67,51.05 60.01,51.05 IC4.25 | v44.2,63.05 44.2,61.82 41.34,58.96 41.34,52.2 v42.48,51.05
  Bottom 0.203: EXTOUT.4 93.2,9.8 v66,37 65.91,37.05 65.91,38.77 61.63,43.05 v61.63,46.86 61.72,46.86 63.63,48.77 63.63,49.24 63.15,49.72 62.77,49.72 60.58,47.53 60.58,44.39 59.72,43.53 50.58,43.53 43.05,51.05 v42.48,51.05 | v44.2,63.05 48.39,67.25 LCD.13
D23  (via drill 0.3)
  Top 0.203: v53.53,58.01 58.39,53.15 58.39,52.86 59.34,51.91 59.91,51.91 IC4.26
  Bottom 0.203: v53.53,58.01 53.53,64.77 51.05,67.25 LCD.14
D+
  Top 0.203: IC0.5 18.48,41.62 18.48,43.24 17.34,44.39 11.34,44.39 7.53,40.58 7.53,38.2 USB.D+
D-
  Top 0.203: IC0.6 19.72,41.53 19.72,40.86 18,39.15 10.48,39.15 9.53,38.2 USB.D-
GND  (via drill 0.3)
  Top 0.203: 64.1,53.3 63,53.3 62.8,53.5 IC4.28 59.91,53.53 59.72,53.72 v58.67,53.72 58.67,53.82 54.29,58.2 54.29,59.24 IC4.39 54.2,59.34 54.1,59.44 54.1,62.67 54.86,63.44 54.86,63.63 C5.2 | 26.77,58.77 26.77,58.1 23.05,54.39 23.05,54.01 IC7.2 | 26.77,58.77 27.34,59.34 27.34,59.82 27.62,60.1 29.91,60.1 30.1,59.91 30.1,59.05 29.24,58.2 28.77,58.2 IC3.4 | 26.77,58.77 25.34,58.77 25.15,58.96 25.15,60.48 18.38,67.25 18,67.25 LCD.1 | 13.53,41.62 IC0.1 13.43,41.53 12.57,41.53 v10.86,39.81 | 44.48,39.43 49.44,39.43 49.91,38.96 52.39,38.96 C9.2 | 44.48,39.43 43.43,38.39 C2.- | 22.95,36.58 23.34,36.58 IC1.4 | D1.A 26.96,28.96 26.96,30.38 27.05,30.38 28.29,31.62 42.77,31.62 IC2.1 | v42.86,45.15 42.86,47.34 BAT.P$1 | 44.48,39.43 v44.48,41.15 | 19.14,38.77 13.62,38.77 12.76,37.91 12.57,37.91 RB.2 12.48,37.81 10.76,37.81 9.81,36.86 8.67,36.86 7.53,35.72 USB.GND 7.53,35.62 9.34,33.81 9.34,22.38 C0.- | CA1.2 43.43,50.96 43.43,51.15 42.67,51.91 42.67,56.1 43.43,56.86 CA0.2 43.53,56.96 44.29,57.72 | 44.29,57.72 46.01,57.72 46.2,57.53 46.2,54.58 47.24,53.53 48.39,53.53 IC4.6 | C8.2 33.43,64.1 31.34,64.1 28.19,67.25 LCD.5 | JP2.2 12.86,74.68 13.81,74.68 15.05,73.44 18.38,73.44 19.34,72.48 19.34,71.72 20.48,70.58 31.53,70.58 33.15,72.2 JP2.17 | 44.29,57.72 44.2,57.72 43.53,58.39 43.53,60.01 47.53,64.01 47.53,71.15 48.29,71.91 RF.3 | 66.01,14 66.01,13.05 TVS6.C | 66.1,20.95 TVS5.C | 48.58,22.48 T3.1 | 74.58,24.95 T7.1 | v57.34,52.39 55.05,50.1 55.05,47.72 IC4.18 | IC6.22 76.96,51.05 77.44,51.05 IC6.21 77.53,51.15 77.53,51.82 78.68,52.96 79.53,52.96 | 79.53,52.96 79.53,51.15 IC6.18 79.44,51.05 79.44,46.77 80.58,45.62 80.58,45.53
  Top 0.203: 79.53,52.96 79.53,53.91 CE1.2 79.53,54.01 80.39,54.86 80.39,56.29 80.11,56.58 74.3,56.58 73.44,55.72 73.25,55.72 CE0.2 | 74.49,42.29 74.11,42.67 74.01,42.67 73.63,43.05 73.63,43.72 IC6.2 73.53,43.81 73.53,44.48 70.01,48.01 70.01,49.43 C12.2 C13.2 68.48,49.53 v66.58,49.53 | 74.49,42.29 75.44,41.34 C6.1 75.53,41.34 77.72,41.34 79.44,43.05 79.44,43.72 IC6.11 79.53,43.81 79.53,44.48 80.58,45.53 | 74.49,42.29 72.01,39.81 CV.2 | 80.58,45.53 84.77,45.53 RBS.1 84.87,45.53 v86.2,45.53 | MICROSD.P$2 82.68,75.63 82.68,68.1 82.68,66.48 MICROSD.GND1 | MICROSD.GND3 68.1,66.1 68.1,74.87 67.34,75.63 MICROSD.P$1 67.15,75.72 64.39,75.72 61.72,73.06 60.77,73.06 ISP.6 | B3.2 98.87,48.1 98.87,52.1 100.01,53.24 100.01,57.05 98.87,58.2 B2.2 98.87,58.29 100.01,59.44 100.01,64.39 98.87,65.53 98.87,68.39 B1.2 98.77,68.1 | 78.77,22.67 78.77,24.1 TVS7.C | 85.15,16.29 85.15,14.86 T8.1
  Top 0.305: MICROSD.6 78.25,68.15 78.1,68.3 82.48,68.3 82.68,68.1
  Top 0.406: C3.2 64.1,52.5 64.1,53.3 64.1,54.5 C4.2 | TVSR.A 77.2,4.6 80.1,4.6 81,5.5 86,5.5 87.6,3.9 RAIN.2
  Top 0.61: CL.2 20.55,21.95 C1.- | C2.- 43.2,32.01 IC2.1 | TVS1.C 37.21,21.2 T1.1 | TVS3.C 50.21,21.2 T3.1 | TVS5.C 63.21,21.2 T5.1 | TVS7.C 75.56,24.35 T7.1 | TVS8.C 85.96,13.95 T8.1 | TVS6.C 64.5,12.8 64.3,13 61.9,13 T6.1 | TVS4.C 50.21,11.7 T4.1 | TVS2.C 37.71,11.7 T2.1
  Bottom 0.203: 94.68,33.5 91.1,33.5 RJ45.SHIELD0 91,33.5 87.5,30 85.2,30 RJ45.GND | 94.68,33.5 94.8,33.5 98.7,29.6 98.9,29.6 RJ45.Y- RJ45.G- 98.95,21.05 96.8,18.9 96.8,15.84 EXTOUT.7 95.7,14.9 93.2,17.4 91.1,17.4 RJ45.SHIELD1 | v10.86,39.81 10.86,37.91 9.81,36.86 8.67,36.86 7.53,35.72 USB.GND | v42.86,45.15 42.86,42.77 v44.48,41.15 | LCD.5 28.19,67.34 33.15,72.29 JP2.17 33.24,72.29 41.24,72.29 42.77,73.82 46.29,73.82 48.1,72.01 48.29,72.01 RF.3 48.39,71.91 57.82,71.91 60.29,69.44 61.15,69.44 61.82,70.1 61.82,71.91 60.77,72.96 ISP.6 | v57.34,52.39 v58.67,53.72 62.39,53.72 v66.58,49.53 | 94.68,42.96 98.77,47.05 98.77,48.01 B3.2 | 94.68,33.5 94.68,42.96 | v86.2,45.53 92.01,45.53 94.58,42.96 94.68,42.96
  pour Top (isolate 0.61): 0,84 102,84 102,0 0,0
  pour Bottom (isolate 1.27): 0,84 102,84 102,0 0,0
INT0  (via drill 0.3)
  Top 0.203: v33.62,57.24 41.62,49.24 45.43,49.24 45.72,48.96 46.58,48.96 47.05,49.43 48.39,49.43 IC4.11 | v24.57,71.25 24.57,71.53 24.38,71.72 24.38,73.53 25.53,74.68 JP2.12
  Bottom 0.203: v33.62,57.24 24.57,66.29 v24.57,71.25
INT1
  Top 0.203: IC4.12 RC.1
INT2  (via drill 0.3)
  Top 0.203: v51.72,60.96 51.72,59.34 IC4.42 | v45.24,63.25 45.24,63.44 41.81,66.86 41.81,68.39 v36.2,74.01
  Bottom 0.203: v51.72,60.96 49.44,63.25 v45.24,63.25 | v36.2,74.01 35.53,74.01 33.62,75.91 31.81,75.91 30.67,74.77 JP2.16
LEDA
  Top 0.203: REA.2 95.85,33.15 98.2,30.8 99.9,30.8 100.7,30 100.7,20.64 RJ45.G+
LEDB
  Top 0.203: REB.2 96.8,37.7 98.4,36.1 98.4,32.66 RJ45.Y+
MISO  (via drill 0.3)
  Top 0.203: 46.62,57.67 45.72,58.58 v44.2,58.58 | 46.62,57.67 47.53,56.77 48.39,56.77 IC4.2 | v76.01,44.96 76.2,44.77 76.2,43.81 IC6.6 | 77.53,62.2 77.53,63.25 79.34,65.06 79.34,65.53 MICROSD.7 | 77.53,62.2 v77.53,60.1 | v77.44,62.2 77.53,62.2 | v48.67,59.72 46.62,57.67 | v49.53,60.58 50.67,61.72 50.67,62.1 54.2,65.63 60.96,65.63 63.25,67.91 ISP.1
  Bottom 0.203: v44.2,58.58 34.86,58.58 27.15,66.29 27.15,71.34 28,72.2 JP2.13 | v76.01,44.96 76.2,44.96 76.68,44.48 77.06,44.48 77.53,44.96 v77.53,60.1 | v77.44,62.2 77.15,61.91 74.77,61.91 68.77,67.91 63.34,67.91 ISP.1 | v49.53,60.58 v48.67,59.72
MOSI  (via drill 0.3)
  Top 0.203: v76.87,45.15 76.87,43.81 IC6.7 | v73.06,60.1 73.06,60.96 74.82,62.72 | 74.82,62.72 74.96,62.87 74.96,65.53 MICROSD.3 | v48.48,58.67 48.48,57.53 IC4.1 | v49.91,61.91 49.91,64.2 52.58,66.86 52.58,68.39 54.67,70.48 60.67,70.48 ISP.4 | v74.96,62.58 74.82,62.72
  Bottom 0.203: v76.87,45.15 76.87,56.29 v73.06,60.1 | v48.48,58.67 50.2,60.39 50.2,61.63 v49.91,61.91 | 58.72,72.53 60.67,70.58 ISP.4 | 58.72,72.53 57.05,74.2 42.58,74.2 41.72,73.34 36.01,73.34 35.91,73.44 30.29,73.44 29.05,74.68 28.1,74.68 JP2.14 | v74.96,62.58 74.68,62.58 67.82,69.44 62.77,69.44 62.2,70.01 62.2,73.06 61.15,74.1 60.29,74.1 58.72,72.53
N$1
  Top 0.61: J.2 1.9,56.1 4.2,53.8 4.2,47 0.6,43.4 0.6,18.9 3.3,16.2 PWR.2
N$3  (via drill 0.3)
  Top 0.203: v48.58,43.43 48.67,43.53 50.2,43.53 RC.2
  Top 0.406: RAIN.1 81,3.9 79.4,2.3 75.05,2.3 TVSR.C
  Bottom 0.203: v48.58,43.43 48.58,43.24 82.49,9.33 82.49,3.91 RAIN.1
N$4
  Top 0.203: IC5.5 59.84,32.57 R6.2
N$5
  Top 0.203: IC5.6 61.1,33.3 R7.2
N$6
  Top 0.203: X.1 22.2,43.9 21.1,42.8 21.1,41.62 IC0.7
N$7
  Top 0.203: IC5.7 62.38,33.62 65.1,30.9 65.5,30.9 R8.2
N$8
  Top 0.203: IC3.1 27.21,62.01 X0.1
N$9
  Top 0.61: JP.1 16.9,8.4 15.6,9.7 13.2,9.7 F0.1
  Bottom 0.61: JP.1 16.9,14.1 0.6,30.4 0.6,45.8 4.2,49.4 4.2,51 1.9,53.3 J.3
N$10
  Top 0.203: IC5.4 58.56,31.84 R5.2
N$11
  Top 0.203: IC5.3 57.3,31.11 R4.2
N$12
  Top 0.203: IC5.2 56.02,30.38 R3.2
N$13
  Top 0.203: R2.2 54.7,33 54.8,33.1 54.8,34.4 IC5.1
N$14
  Top 0.203: R1.2 52.7,35.9 56,39.2 56,40.5 IC5.15
N$15
  Top 0.203: CA0.1 45.3,56.9 45.3,56.2 45.2,56.1 44.7,56.1 43.6,55 43.6,54.9 XA.1 43.6,54.8 44.5,53.9 44.5,53.8 44.6,53.7 46,53.7 47,52.7 IC4.7
N$16
  Top 0.61: TVS1.A 39.6,16.4 T1.4 33.2,16.4 32.5,16.4 30.3,14.2 30.3,6.4 32.2,4.5 32.2,3.9 S12.1
N$17
  Top 0.61: T2.4 37.2,6.9 | 37.2,6.9 39.6,6.9 TVS2.A | S12.2 37.34,6.76 37.2,6.9
N$18
  Top 0.61: TVS3.A 52.6,16.4 T3.4 46.2,16.4 45,16.4 42.5,13.9 42.5,3.9 S34.1
N$19
  Top 0.203: 45.3,51.9 45.3,50.9 CA1.1 | 45.3,51.9 45.3,52.7 XA.3 | 45.3,51.9 IC4.8
N$20
  Top 0.61: T4.4 47.4,6.9 | 47.4,6.9 52.6,6.9 TVS4.A | S34.2 47.5,6.8 47.4,6.9
N$21
  Top 0.203: T1.3 33.9,25.3 48.7,25.3 51.4,28 R1.1
N$22
  Top 0.61: TVS5.A 65.6,16.4 T5.4 59.2,16.4 58,16.4 55.8,14.2 55.8,7 54.4,5.6 54.3,5.6 52.6,3.9 S56.1
N$23
  Top 0.61: S56.2 57.66,5.96 58.5,6.8 59.4,6.8 T6.4 59.8,6.9 63,6.9 64.5,8.4 TVS6.A
N$24
  Top 0.61: TVS7.A 77.6,18.9 T7.4 72.4,18.6 72.4,15.1 69.1,11.8 69.1,8.2 69,7.9 66.7,5.6 64.5,5.6 62.8,3.9 S78.1
N$25
  Top 0.61: TVS8.A 87.85,8.4 T8.4 82.7,8.4 81.6,8.4 80.1,6.9 71.4,6.9 68.4,3.9 S78.2
N$26  (via drill 0.3)
  Top 0.203: v32.9,14.3 T2.3 | v43.3,24.7 43.5,24.9 48.9,24.9 51,27 53.2,27 54.2,28 R2.1
  Bottom 0.203: v43.3,24.7 v32.9,14.3
N$27
  Top 0.203: T3.3 44.2,22.9 45.8,24.5 49.1,24.5 51.2,26.6 53.4,26.6 53.8,27 55.2,27 56.2,28 R3.1
N$28  (via drill 0.3)
  Top 0.203: v45,14.8 44.2,14 T4.3 | v57.2,27 58.2,28 R4.1
  Bottom 0.203: v57.2,27 v45,14.8
N$29
  Top 0.203: T5.3 57.2,24.5 60.6,27.9 60.6,28 60.7,28.1 R5.1
N$30
  Top 0.203: IC3.2 26.75,60.73 X0.4
N$31  (via drill 0.3)
  Top 0.203: v57.6,14.8 57.2,14.4 T6.3 | v61.7,27.2 62.5,28 R6.1
  Bottom 0.203: v57.6,14.8 57.6,23.1 v61.7,27.2
N$33
  Top 0.203: T7.3 70.1,25.1 68.1,25.1 65.2,28 R7.1
N$34
  Top 0.203: REA.1 94.2,35.72 94.2,36.29 94.96,37.05 94.96,41.43 88.87,47.53 88.87,60.48 88.3,61.05 79.34,61.05 75.63,57.34 72.77,57.34 71.91,56.48 71.91,53.15 72.96,52.1 73.25,52.1 73.53,51.82 73.53,51.15 IC6.27
N$35  (via drill 0.3)
  Top 0.203: v79.2,16 79.2,15.2 80.6,15.2 80.7,15.1 T8.3 | v67.8,27.4 67.2,28 R8.1
  Bottom 0.203: v67.8,27.4 v79.2,16
N$36
  Top 0.203: BAT.P$2 27.1,47.4 27.2,47.5 27.2,58.5 28.2,59.5 28.7,59.5 IC3.3
N$37
  Top 0.203: REB.1 94.11,37.72 94.11,41.72 88.49,47.34 88.49,58.86 88.3,59.05 77.92,59.05 75.82,56.96 72.96,56.96 72.3,56.29 72.3,53.34 73.15,52.48 73.53,52.48 74.2,51.82 74.2,51.15 IC6.26
N$39
  Top 0.203: CV.1 72,42.77 IC6.1
N$40
  Top 0.203: X.3 22.45,41.5 IC0.8
N$41
  Top 0.203: CE0.1 75.08,53.92 XE.3 75.1,53.9 75.6,53.4 75.6,51.1 IC6.24
N$42
  Top 0.203: CE1.1 79.47,55.65 XE.1 77.3,55.7 76.8,55.7 76.3,55.2 76.3,53 76.2,52.9 76.2,51.1 IC6.23
N$43
  Top 0.61: D2.A RZ.2
N$45
  Top 0.61: RSC1.1 RSC.1 17.43,31.33 IC1.8 | IC1.7 IC1.8 | IC1.8 22.89,32.89 22.9,32.9 IC1.1
N$46
  Top 0.61: IC1.2 25.76,34.16 D1.C 28.59,32.92 L1'.1 32.64,35.34 L1.1
N$49
  Top 0.61: IC1.3 26.31,35.44 CT.1
N$54  (via drill 0.3)
  Top 0.203: C6.2 77.05,39.55 v77.7,38.9 | v79.4,38.9 79.4,39.25 RR-.1 RR+.2
  Bottom 0.203: v77.7,38.9 v79.4,38.9
N$55
  Top 0.61: RB.1 RT.2 14.8,36.7 IC1.5
N$59
  Top 0.203: RBS.2 81.57,43.6 IC6.14
QH*  (via drill 0.3)
  Top 0.203: v64.5,39.3 63.6,40.2 63.6,40.5 IC5.9
  Bottom 0.203: EXTOUT.2 93.2,7.2 64.6,35.8 64.6,39.3 v64.5,39.3
RD+
  Top 0.203: IC6.13 80.8,43.7 80.8,42.4 81.7,41.5 81.7,41.4 81.6,41.3 RR+.1 81.6,41.2 84.8,38 84.8,32.7 86.4,31.1 86.4,24.8 87.6,23.6 RJ45.RD+
RD-
  Top 0.203: RJ45.RD- 85.1,27.5 78.7,33.9 78.7,40.2 79.8,41.3 RR-.2 79.9,41.3 80.1,41.5 80.1,43.7 IC6.12
RECAC
  Top 0.406: IC1.6 15.94,35.44 15.6,35.1 13.1,35.1 12.6,34.6 12.6,32.6 RSC.2
  Top 0.61: 14.85,21.55 10.4,17.1 CH.1 10.3,16.5 10.3,14.6 8,12.3 8.1,12.2 D0.C | 14.85,21.55 C0.+ | RSC.2 RSC1.2 14.6,21.8 14.85,21.55
RESET  (via drill 0.3)
  Top 0.203: v26.57,49.43 17.91,49.43 C11.2 | v47.15,54.48 47.72,55.05 48.39,55.05 IC4.4 | ISP.5 63.34,72.96 64.39,71.91 64.39,67.91 68.77,63.53 68.77,54.58 RR.1 68.87,54.48 69.25,54.1 v69.25,53.44 | v72.2,50.48 73.06,49.62 74.39,49.62 78.77,45.24 78.77,43.81 IC6.10 | v53.34,54.96 53.72,54.96 53.82,55.05 55.05,55.05 v55.72,54.39
  Bottom 0.203: v26.57,49.43 32.48,49.43 37.53,54.48 v47.15,54.48 52.86,54.48 v53.34,54.96 | v72.2,50.48 v69.25,53.44 69.15,53.44 64.1,58.48 60.87,58.48 56.77,54.39 v55.72,54.39
RTS
  Top 0.406: IC0.14 15.99,49.24 C11.1
RXD  (via drill 0.3)
  Top 0.203: v10.86,43.05 13.34,43.05 14.1,42.29 14.1,42.2 14.67,41.62 IC0.2 14.67,41.72 16.67,43.72 v17.14,43.72 | v46.2,45.81 49.44,49.05 49.44,50.67 49.05,51.05 48.48,51.05 IC4.9
  Bottom 0.203: v10.86,43.05 10.86,66.48 10,67.34 10,67.72 14.19,71.91 14.19,75.25 14.86,75.91 21.81,75.91 22.95,74.77 JP2.10 | v46.2,45.81 19.24,45.81 v17.14,43.72
SCK  (via drill 0.3)
  Top 0.203: v46.86,55.91 48.39,55.91 IC4.3 | v74.3,48.29 74.58,48.29 77.53,45.34 77.53,43.81 IC6.8 | v74.3,58.01 74.3,59.91 77.06,62.67 77.06,64.29 | 77.06,64.29 77.06,65.53 MICROSD.5 | v76.96,64.29 77.06,64.29 | v54.01,54.39 54.58,54.39 v55.15,53.82
  Bottom 0.203: JP2.11 25.62,72.2 26.57,71.25 26.57,66.29 36.96,55.91 v46.86,55.91 47.34,55.91 47.82,55.44 52.96,55.44 53.15,55.63 53.53,55.63 54.01,55.15 v54.01,54.39 | v74.3,48.29 v74.3,58.01 74.2,58.01 73.34,58.86 60.67,58.86 59.15,57.34 57.82,57.34 55.05,54.58 55.05,54.2 55.15,54.1 v55.15,53.82 | v76.96,64.29 70.77,70.48 63.34,70.48 ISP.3
SCL  (via drill 0.3)
  Top 0.203: RCL.1 35.01,59.6 IC3.6 | 15.43,69.44 15.43,72.2 JP2.3 | 15.43,69.44 15.43,61.91 22,55.34 22,54.01 IC7.1 | v51.44,46.39 55.15,46.39 55.72,46.96 55.72,47.62 IC4.19 | v46.39,49.62 42.48,49.62 38.29,53.82 38.29,58.77 37.53,59.53 RCL.1 | 15.43,69.44 33.15,69.44 34.77,67.82 34.77,66.29 37.62,63.44 37.81,63.44 38.29,62.96 38.29,60.39 37.53,59.63 RCL.1
  Bottom 0.203: v51.44,46.39 49.62,46.39 v46.39,49.62
SDA  (via drill 0.3)
  Top 0.203: RDA.1 34.97,58.1 IC3.5 34.86,58.1 33.62,58.1 32.96,57.44 32.96,57.05 | JP2.1 12.86,72.2 12.86,61.91 21.72,53.05 23.34,53.05 23.91,53.63 23.91,53.91 IC7.3 24,54.01 v26.57,54.01 | 32.96,57.05 39.43,50.58 39.43,46.39 41.34,44.48 54.01,44.48 56.58,47.05 56.58,47.62 IC4.20 | v32.77,56.96 32.86,57.05 32.96,57.05
  Bottom 0.203: v26.57,54.01 29.81,54.01 v32.77,56.96
TCT  (via drill 0.3)
  Top 0.203: 83.8,56.1 82.8,56.1 RT+.2 | 83.8,56.1 84.9,56.1 RT-.1 85,56.1 85.9,56.1 86,56.2 87.4,56.2 C7.2 87.4,56.3 87.5,56.4 L2.1 | v83.8,55.3 83.8,56.1
  Bottom 0.203: v83.8,55.3 83.8,26.2 85.1,24.9 RJ45.P4
TD+  (via drill 0.3)
  Top 0.203: RT+.1 82.8,54.4 82,54.4 80.1,52.5 80.1,51.1 IC6.17 80.1,51 v80.1,49.7 80.1,49.8
  Bottom 0.203: v80.1,49.7 83.4,46.4 83.4,26 83.8,25.6 83.8,24.7 84.9,23.6 85.4,23.6 86.4,22.6 86.4,22.3 87.6,21.1 RJ45.TD+
TD-
  Top 0.203: IC6.16 80.8,51.08 80.8,52.6 81.6,53.4 83.4,53.4 84.35,54.35 RT-.2 84.9,47.7 90.3,42.3 90.3,34.9 89.3,33.9 89.3,23.4 88.2,22.3 85.2,22.3 RJ45.TD-
TXD
  Top 0.203: 21.67,75.2 21.81,75.06 21.81,74.3 22.95,73.15 22.95,72.29 JP2.9 | 21.67,75.2 20.57,76.3 12.19,76.3 11.34,75.44 11.34,52.77 15.34,48.77 15.34,46.48 15.53,46.29 16,46.29 19.14,43.15 19.14,40.86 18.95,40.67 16.86,40.67 16,41.53 IC0.3 | 21.67,75.2 22.38,75.91 26,75.91 26.67,75.25 26.67,74.58 27.62,73.63 33.43,73.63 36.77,70.29 36.77,66.86 40.01,63.63 40.01,52.67 42.67,50.01 45.91,50.01 46.2,50.29 48.39,50.29 IC4.10
VCC  (via drill 0.3)
  Top 0.203: IC4.27 62.2,52.7 62.4,52.5 C3.1 62.29,52.48 62.29,48.39 | IC4.38 55,60.7 54.9,60.8 C5.1 54.96,62.01 56.67,63.72 59.82,63.72 RPR.2 59.91,63.72 60.29,63.72 65.34,58.67 65.34,50.58 63.15,48.39 62.29,48.39 | MICROSD.4 76.1,65.6 76.1,64.4 75.9,64.2 75.9,63.5 RSD.2 75.82,63.44 75.82,62.01 71.53,57.72 71.53,51.15 | 71.53,51.15 C12.1 C13.1 68.48,51.24 67.15,52.58 67.15,53.44 | 71.53,51.15 72.88,51.15 IC6.28 72.96,50.96 72.96,50.39 73.34,50.01 74.58,50.01 74.87,50.29 | v17.24,42.77 17.24,41.62 IC0.4 | v13.91,46.1 13.24,46.77 IC0.16 | v22.67,55.34 23.91,56.58 IC7.4 | v52.77,50.58 49.05,54.29 48.48,54.29 IC4.5 | v54.1,50.01 54.1,47.81 54.2,47.72 IC4.17 | 53.24,40.6 53.24,38.29 53.05,38.1 48.29,38.1 C2.+ 47.72,38.39 47.34,38.77 v46.01,38.77 | ROE.2 60.96,45.81 61.34,45.81 62.29,44.86 62.29,40.58 IC5.10 | 62.29,48.39 62.29,46.67 61.44,45.81 ROE.2 | 58.1,45.81 54.77,42.48 54.77,40.77 IC5.16 | 58.1,45.81 60.87,45.81 ROE.2 | v58.1,45.91 58.1,45.81 | 67.15,53.44 67.15,54.48 RR.2 | 74.87,50.29 74.87,51.05 IC6.25 | v81.44,52.29 81.44,51.15 IC6.15 | v78.87,52.29 78.87,51.15 IC6.19 78.77,51.05 78.2,51.05 IC6.20 78.2,50.96 78.2,50.39 77.82,50.01 75.25,50.01 74.96,50.29 74.87,50.29 | v86.3,59.72 86.77,60.2 87.44,60.2 L2.2 | v67.06,53.44 67.15,53.44
  Top 0.406: C10.2 13.21,46.95 IC0.16 | IC5.16 54.7,40.6 53.24,40.6 52.4,40.6 C9.1
  Top 0.61: C2.+ 48,30.7 IC2.4
  Bottom 0.203: 22.57,71.06 23.43,71.06 24.19,71.82 24.19,72.48 25.15,73.44 28.48,73.44 29.62,72.29 30.57,72.29 JP2.15 | 22.57,71.06 21.62,72.01 21.62,72.67 20.67,73.63 19.05,73.63 18,74.68 JP2.6 | 22.57,71.06 22.57,68.86 22.1,68.39 22.1,56.01 22.67,55.44 v22.67,55.34 22.67,54.96 13.91,46.2 v13.91,46.1 v17.24,42.77 42.01,42.77 v46.01,38.77 | 53.53,50.58 v52.77,50.58 | 53.53,50.58 v54.1,50.01 56.58,50.01 58.1,48.48 v58.1,45.91 | v78.87,52.29 v81.44,52.29 81.44,53.82 86.3,58.67 | 86.3,58.67 v86.3,59.72 | EXTOUT.1 95.82,7.24 95.82,8.29 100.01,12.48 100.01,54.2 96.3,57.91 87.15,57.91 86.39,58.67 86.3,58.67 | v67.06,53.44 62.39,58.1 61.05,58.1 60.58,57.63 60.58,57.53 53.63,50.58 53.53,50.58
VIN  (via drill 0.3)
  Top 0.305: LCD.15 53.63,67.34 54.01,67.34 55.63,68.96 59.72,68.96 60.67,68.01 ISP.2 | RDA.2 39.15,59.53 RCL.2 39.24,59.72 v39.24,63.53 | v14,33.05 14.2,33 | C8.1 35.05,64.2 33.62,65.63 32.86,65.63 31.72,66.77 31.72,68.39 31.15,68.96 22.19,68.96 20.57,67.34 LCD.2 | 35.15,62.77 v37.62,62.77
  Top 0.406: RT.1 14.2,33 15.6,31.6 15.6,27.4 17.6,25.4 23.1,25.4 25.7,22.8 C1.+ | C8.1 35.15,62.77 35.15,62.28 IC3.8
  Top 0.61: D2.C 21.4,15.7 22.25,16.55 CL.1 22.25,17.95 C1.+ 26.5,22 27.3,22 v28.5,23.2 | L1'.2 31,28.1 | 31,28.1 25.7,22.8 | 31,28.1 34.6,28.1 L1.2 | IC2.3 39.91,27.19 v39.9,27.2
  Bottom 0.305: LCD.15 53.53,67.34 53.05,67.34 50.29,70.1 47.72,70.1 45.91,71.91 RF.2 45.72,71.91 42.39,68.58 42.39,66.67 v39.24,63.53 39.15,63.44 38.29,63.44 v37.62,62.77 | 11.43,35.62 9.53,35.62 USB.VBUS | v14,33.05 11.43,35.62 | JP2.4 15.43,74.68 16.29,74.68 17.53,73.44 18.38,73.44 19.24,72.58 19.24,68.58 20.48,67.34 LCD.2 20.38,67.25 11.53,58.39 11.53,35.72 11.43,35.62
  Bottom 0.61: v39.9,27.2 32.5,27.2 v28.5,23.2

### Text on the board
tNames: OpenSprinkler v2.3a | www.opensprinkler.com | GND VIN VCC A06 RXD INT0 SI INT2 D15 | A3 VIN GND | SDA SCL A05 A07 TXD SCK SO VCC GND | PWR | EXTOUT | S1-8 | RAIN
BoxDim: Serpac WM-032C Enclosure | All units are in inch | Left | Right | Front | Bottom